# Altium schematic sheet Sheet1.SchDoc
size A; SheetNumber: 1; SheetTotal: 1
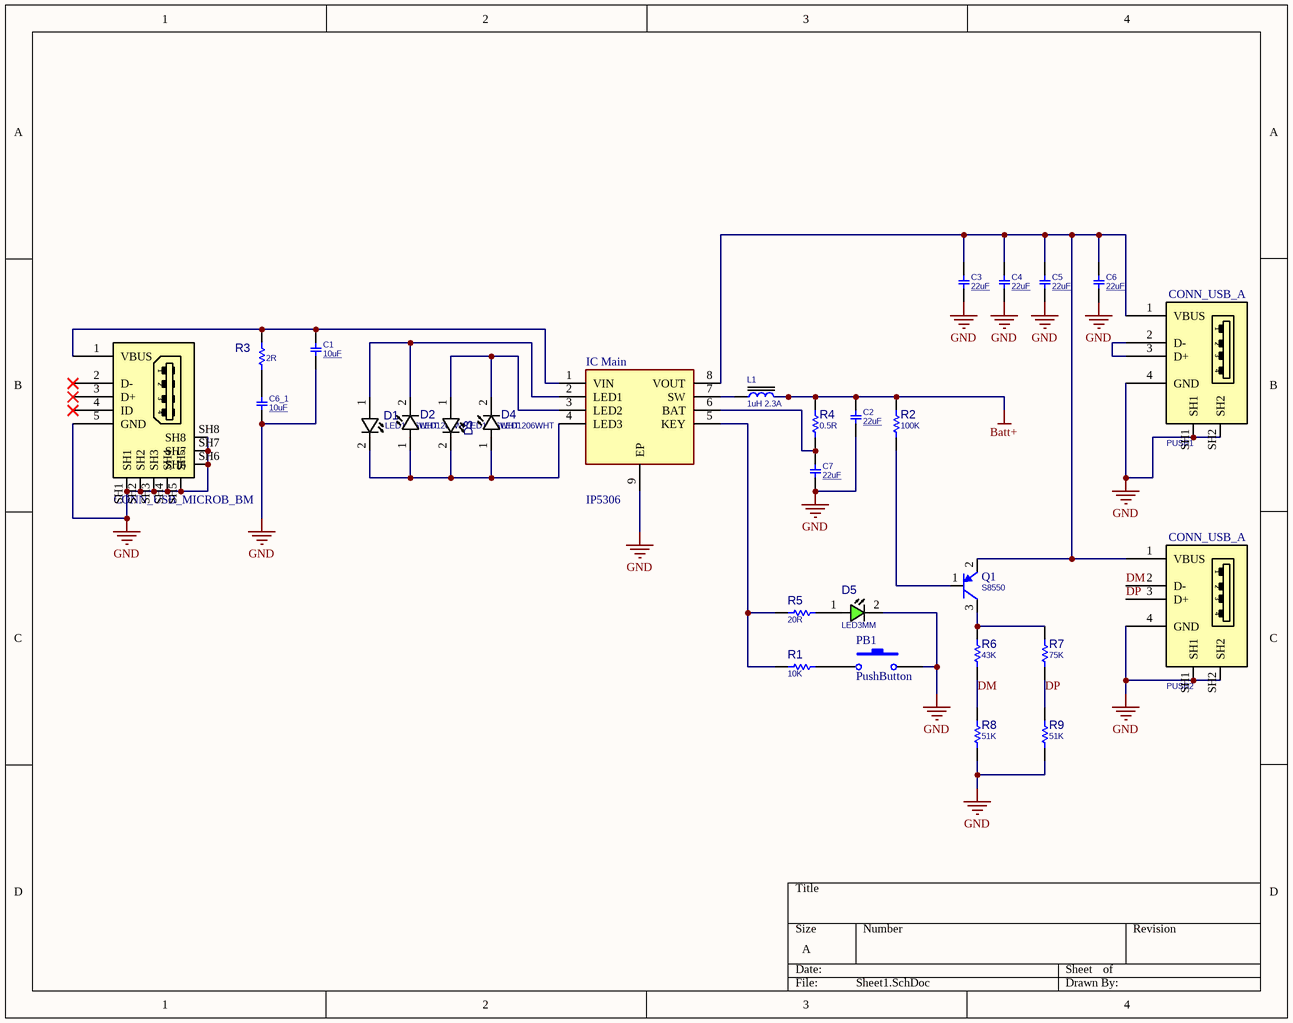
[diagram p0: Sheet1.SchDoc]

## Parts
?  CONN_USB_MICROB_BM  [USB_MICRO_AB_BM_SHS]
C1  10uF  [C1206]
C2  22uF  [C1206]
C3  22uF  [C1206]
C4  22uF  [C1206]
C5  22uF  [C1206]
C6  22uF  [C1206]
C6_1  10uF  [C1206]
C7  22uF  [C1206]
D1  LED1206WHT  [LED1206WHT]
D2  LED1206WHT  [LED1206WHT]
D3  LED1206WHT  [LED1206WHT]
D4  LED1206WHT  [LED1206WHT]
D5  LED3MM  [LED3MM]
IC_Main  IP5306  [SOIC127P600X165-9N]
L1  1uH 2.3A  [L0806]
PB1  PushButton  [uc_pb3]
PUSB1  CONN_USB_A  [USB_A_REC_RA_THD]
PUSB2  CONN_USB_A  [USB_A_REC_RA_THD]
Q1  S8550  [SOT23_3]
R1  10K  [R0603]
R2  100K  [R0603]
R3  2R  [R0603]
R4  0.5R  [R0603]
R5  20R  [R0603]
R6  43K  [R0603]
R7  75K  [R0603]
R8  51K  [R0603]
R9  51K  [R0603]

## Nets
Batt+: C2.2 L1.2 R2.1 R4.1
GND: ?.5(GND) ?.SH1 ?.SH2 ?.SH3 ?.SH4 ?.SH5 ?.SH6 ?.SH7 ?.SH8 C1.1 C2.1 C3.1 C4.1 C5.1 C6.1 C6_1.1 C7.1 D5.2(CATHODE) IC_Main.9(EP) PB1.2 PUSB1.4(GND) PUSB1.SH1 PUSB1.SH2 PUSB2.4(GND) PUSB2.SH1 PUSB2.SH2 R8.2 R9.2
DM: PUSB2.2(D-) R6.2 R8.1
DP: PUSB2.3(D+) R7.2 R9.1
Net?_1: ?.1(VBUS) C1.2 IC_Main.1(VIN) R3.2
NetC3_2: C3.2 C4.2 C5.2 C6.2 IC_Main.8(VOUT) PUSB1.1(VBUS) PUSB2.1(VBUS) Q1.2(E)
NetC6_1_2: C6_1.2 R3.1
NetC7_2: C7.2 IC_Main.6(BAT) R4.2
NetD1_1: D1.1(ANODE) D2.2(CATHODE) IC_Main.2(LED1)
NetD1_2: D1.2(CATHODE) D2.1(ANODE) D3.2(CATHODE) D4.1(ANODE) IC_Main.4(LED3)
NetD3_1: D3.1(ANODE) D4.2(CATHODE) IC_Main.3(LED2)
NetD5_1: D5.1(ANODE) R5.2
NetIC_Main_5: IC_Main.5(KEY) R1.1 R5.1
NetIC_Main_7: IC_Main.7(SW) L1.1
NetPB1_1: PB1.1 R1.2
NetPUSB1_2: PUSB1.2(D-) PUSB1.3(D+)
NetQ1_1: Q1.1(B) R2.2
NetQ1_3: Q1.3(C) R6.1 R7.1

Not connected (* = marked no-connect by the designer): ? 2(D-)* 3(D+)* 4(ID)*

## Library data of the parts
? = CONN_USB_MICRO_AB_BM_SHS: CONN, USB, MICRO AB, R/A, SMD, BOTTOM MOUNT; MANF_P#: 1981584-1; MANF: TE; PARAM2: 30VAC; PARAM: 1.8A, -30~85oC; MANF_P#2: HIROSE ZX62-AB-5PA; PRICE: 0.75$; VALUE: CONN_USB_MICROB_BM
C1 C6_1 = CAP_SMD_FILM: CAP, FILM, 10uF, 16V, Acryl, 20%, 1206; PARAM: Acrylic, MetallizedStacked, 20%, -40~85oC; MANF: Murata; PRICE: 100= 40$; DESC: -; MANF_P#: -; PARAM2: 16V; ASSEMBLY: ASSEMBLY; VALUE: 10uF
C2-C7 = CAP_SMD_FILM: CAP, FILM, 680nF, 16V, Acryl, 20%, 1206; PARAM: Acrylic, MetallizedStacked, 20%, -40~85oC; MANF: Murata; PRICE: 100= 40$; DESC: -; MANF_P#: -; PARAM2: 16V; ASSEMBLY: ASSEMBLY; VALUE: 22uF
D1-D4 = LED_SMD_1206_WHT: LED, SMD, 1206, WHITE; DESC: DESCRIPTION; MANF_P#: MANF_PART#; PARAM2: 2.2V; MANF: MANF; ASSEMBLY: ASSEMBLY; PRICE: 36t@Javan; VALUE: LED1206WHT
D5 = LED_THD_3MM: LED, THD, 3MM, GREEN; DESC: DESCRIPTION; MANF_P#: MANF_PART#; PARAM2: 2.2V; MANF: MANF; ASSEMBLY: ASSEMBLY; PRICE: PRICE; VALUE: LED3MM
IC_Main = IP5306: Integrated Circuit; Manufacturer_Name: INJOINIC; Datasheet Link: https://datasheetspdf.com/pdf-file/1139129/Injoinic/IP5306/1; Height: 1.65mm; Manufacturer_Part_Number: IP5306
L1 = IND_SMD_1uH_2.3A_0806: INDUCTOR, 1uH, 2.3A, 70mOhm, 0806; PARAM: 2.3A, 2.7A (Isat); MANF_P#: MAKK2016H1R0M; MANF: Taiyo Yuden; PARAM2: 70mOhm, -40~125oC; PRICE: 0.27$; ASSEMBLY: ASSEMBLY; VALUE: 1uH 2.3A
PUSB1 PUSB2 = CONN_USB_A_REC_RA_THD: CONN, USB, A, RECEPTACLE, R/A, THD; VALUE: CONN_USB_A
Q1 = PNP_S8550_SOT23: BJT, PNP, 25v, 0.5A, SMD, SOT23; PARAM2: 300mW; PARAM: 25v, 0.5A; MANF_P#: S8550; MANF: -; VALUE: S8550
R1-R9 = RES_SMD_0603: RESISTOR, SMD; PARAM: 0.1W; DESC: DESCRIPTION; DIST#: MOUSER; PARAM2: 1%; MANF_P#: -; MANF: -; ASSEMBLY: ASSEMBLY; PRICE: 100= 0.5$
  R1: VALUE: 10K
  R2: VALUE: 100K
  R3: VALUE: 2R
  R4: VALUE: 0.5R
  R5: VALUE: 20R
  R6: VALUE: 43K
  R7: VALUE: 75K
  R8 R9: VALUE: 51K